# Altium project PMOD_LEVELSHIFT.PrjPCB
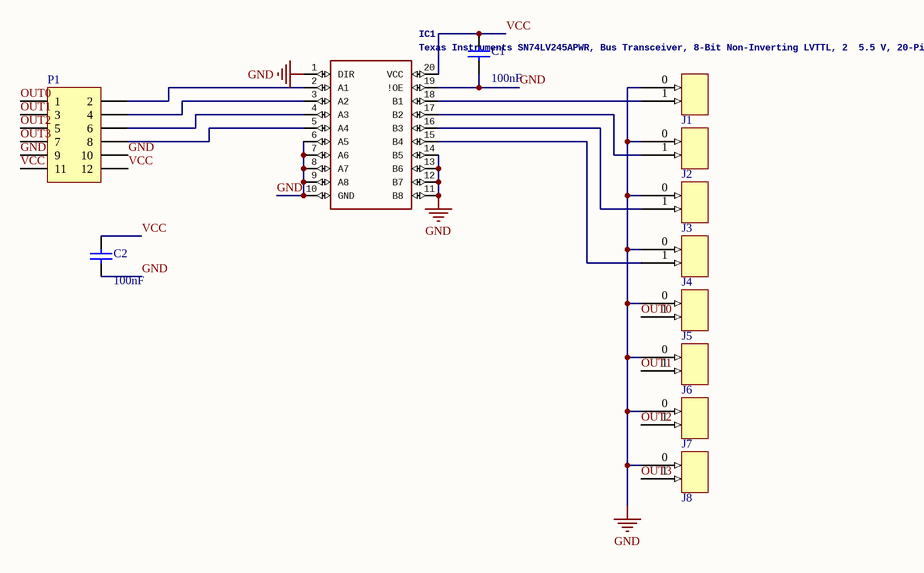
[diagram p0: PMOD_LEVELSHIFT.SchDoc]
1 sheet, 12 parts. Net scope: global (net labels, ports and power ports of the same name join across sheets).
Board file: PMOD_LEVELSHIFT.PcbDoc

## Sheet PMOD_LEVELSHIFT.SchDoc
size A4

### Parts
C1  value 100nF  [*RESC2012X60N]
C2  value 100nF  [*RESC2012X60N]
IC1  Texas Instruments SN74LV245APWR, Bus Transceiver, 8-Bit Non-Inverting LVTTL, 2  5.5 V, 20-Pin TSSOP   Source:  Datasheet  [SOP65P640X120-20N]
J1  BNC_CON  [BNC_CON]  (value not drawn)
J2  BNC_CON  [BNC_CON]  (value not drawn)
J3  BNC_CON  [BNC_CON]  (value not drawn)
J4  BNC_CON  [BNC_CON]  (value not drawn)
J5  BNC_CON  [BNC_CON]  (value not drawn)
J6  BNC_CON  [BNC_CON]  (value not drawn)
J7  BNC_CON  [BNC_CON]  (value not drawn)
J8  BNC_CON  [BNC_CON]  (value not drawn)
P1  (no value)  [HDRRA12W64P254_2X6_1524X254X61]

### Nets
GND: C1.1 C2.1 IC1.1(DIR) IC1.6(A5) IC1.7(A6) IC1.8(A7) IC1.9(A8) IC1.10(GND) IC1.11(B8) IC1.12(B7) IC1.13(B6) IC1.14(B5) IC1.19(!OE) J1.0 J2.0 J3.0 J4.0 J5.0 J6.0 J7.0 J8.0 P1.9 P1.10
OUT0: J5.1 P1.1
OUT1: J6.1 P1.3
OUT2: J7.1 P1.5
OUT3: J8.1 P1.7
VCC: C1.2 C2.2 IC1.20(VCC) P1.11 P1.12
NetIC1_2: IC1.2(A1) P1.2
NetIC1_3: IC1.3(A2) P1.4
NetIC1_4: IC1.4(A3) P1.6
NetIC1_5: IC1.5(A4) P1.8
NetIC1_15: IC1.15(B4) J4.1
NetIC1_16: IC1.16(B3) J3.1
NetIC1_17: IC1.17(B2) J2.1
NetIC1_18: IC1.18(B1) J1.1

### Library data of the parts
C1 C2 = Cap Semi: Capacitor (Semiconductor SIM Model); Published: 8-Jun-2000; LatestRevisionDate: 29-May-2009; LatestRevisionNote: IPC-7351 Footprint Added.; PackageReference: C1206; Publisher: Altium Limited; PackageDescription: Chip Capacitor
IC1 = SN74LV245APWR: RS_Part_Number: 6628483P; RS_Price-Stock: http://uk.rs-online.com/web/p/products/6628483P; Manufacturer_Name: Texas Instruments; Manufacturer_Part_Number: SN74LV245APWR; Height: 1.2mm
P1 = Header 6X2H: Header, 6-Pin, Dual row, Right Angle; LatestRevisionDate: 17-Jul-2002; LatestRevisionNote: Re-released for DXP Platform.; Publisher: Altium Limited